# Altium schematic sheet IMU.SchDoc
size A4
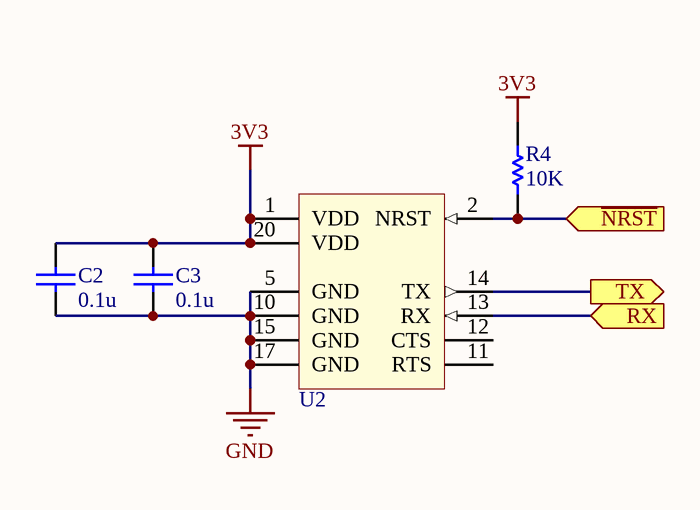
[diagram p0: IMU.SchDoc]

## Parts
C2  value 0.1u  [CAPC1608X90N]  (hidden comment: Cap)
C3  value 0.1u  [CAPC1608X90N]  (hidden comment: Cap)
R4  value 10K  [RESC1608X55N]  (hidden comment: Res1)
U2  LPMS-NAV2  [LPMS-NAV2]  (value not drawn)

## Ports
RX (in), TX (out), ~{NRST} (in)

## Nets
3V3: C2.2 C3.2 R4.2 U2.1(VDD) U2.20(VDD)
GND: C2.1 C3.1 U2.5(GND) U2.10(GND) U2.15(GND) U2.17(GND)
~{NRST}: R4.1 U2.2(NRST) ; port ~{NRST}
RX: U2.13(RX) ; port RX
TX: U2.14(TX) ; port TX

Not connected (* = marked no-connect by the designer): U2 11(RTS) 12(CTS)

## Library data of the parts
C2 C3 = Cap: Capacitor; Published: 8-Jun-2000; LatestRevisionDate: 17-Jul-2002; LatestRevisionNote: Re-released for DXP Platform.; PackageReference: RAD-0.3; Publisher: Altium Limited; PackageDescription: Radial Cap, Thru-Hole; 2 Leads; 0.3 in Pin Spacing
R4 = Res1: Resistor; Published: 8-Jun-2000; LatestRevisionDate: 17-Jul-2002; LatestRevisionNote: Re-released for DXP Platform.; PackageReference: AXIAL-0.3; Publisher: Altium Limited; PackageDescription: Axial Device, Thru-Hole; 2 Leads; 0.3 in Pin Spacing
U2 = LPMS-NAV2: ComponentLink1Description: datasheet; ComponentLink1URL: https://www.lp-research.com/wp-content/uploads/2017/11/LPMS-NAV2Manual20171025.pdf; ComponentLink2Description: official website; ComponentLink2URL: https://lp-research.com/lpms-nav2/